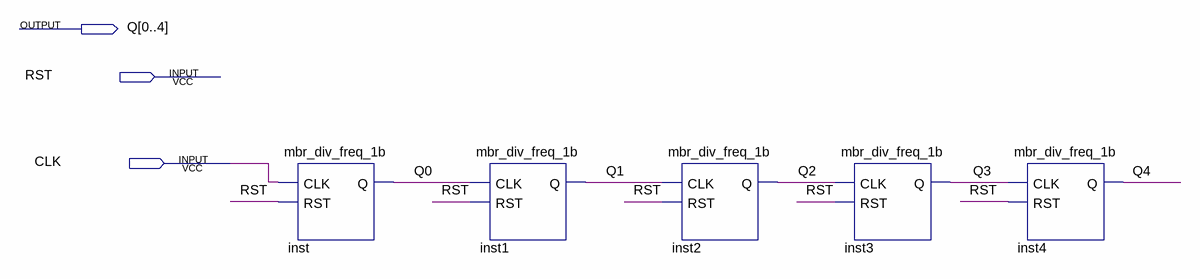
[diagram p0: schematic sheet]
// Quartus schematic mbr_div_freq_5b.bdf as structural Verilog: 5 symbols, 3 pins
module mbr_div_freq_5b (
  input  RST,
  input  CLK,
  output [0:4] Q
);

  mbr_div_freq_1b inst (.CLK(CLK), .RST(RST), .Q(Q[0]));
  mbr_div_freq_1b inst1 (.CLK(Q[0]), .RST(RST), .Q(Q[1]));
  mbr_div_freq_1b inst2 (.CLK(Q[1]), .RST(RST), .Q(Q[2]));
  mbr_div_freq_1b inst3 (.CLK(Q[2]), .RST(RST), .Q(Q[3]));
  mbr_div_freq_1b inst4 (.CLK(Q[3]), .RST(RST), .Q(Q[4]));
endmodule
